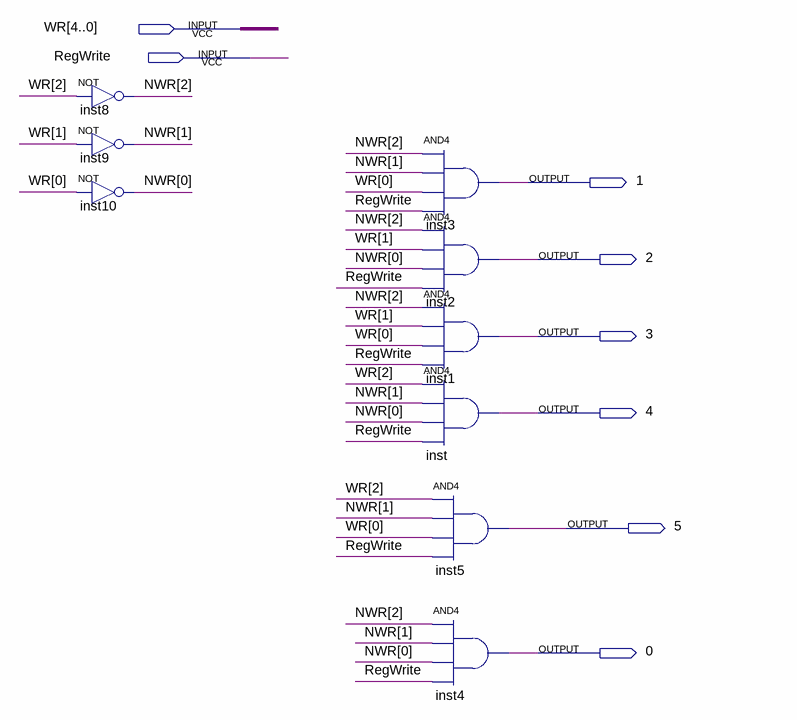
[diagram p0: schematic sheet]
// Quartus schematic DECODER_5BITS.bdf as structural Verilog: 9 symbols, 8 pins
module DECODER_5BITS (
  input  [4:0] WR,
  input  RegWrite,
  output \1 ,
  output \2 ,
  output \3 ,
  output \4 ,
  output \5 ,
  output \0 
);

  wire [2:0] NWR;

  not inst8 (NWR[2], WR[2]);
  not inst9 (NWR[1], WR[1]);
  not inst10 (NWR[0], WR[0]);
  and inst3 (\1 , NWR[2], NWR[1], WR[0], RegWrite);
  and inst2 (\2 , NWR[2], WR[1], NWR[0], RegWrite);
  and inst1 (\3 , NWR[2], WR[1], WR[0], RegWrite);
  and inst (\4 , WR[2], NWR[1], NWR[0], RegWrite);
  and inst5 (\5 , WR[2], NWR[1], WR[0], RegWrite);
  and inst4 (\0 , NWR[2], NWR[1], NWR[0], RegWrite);
endmodule
